# Altium project SMAQ-Board_Design.PrjPcb (part 2 of 3)

## Sheet [5] - Microphone, Sound and LEDs.SchDoc: Microphone,Sound and LEDs
size A4 portrait; ApprovedBy: Team 7; CheckedBy: Charitonidis A.; Author: Charitonidis Alexandros; CompanyName: SMAQ; DrawnBy: Charitonidis A.; Engineer: Charitonidis Alexandros; Organization: SMAQ; Address1: Glasgow; DocumentNumber: SCH-004; Revision: 1.1; SheetNumber: 5; SheetTotal: 5; TeamNumber: 7
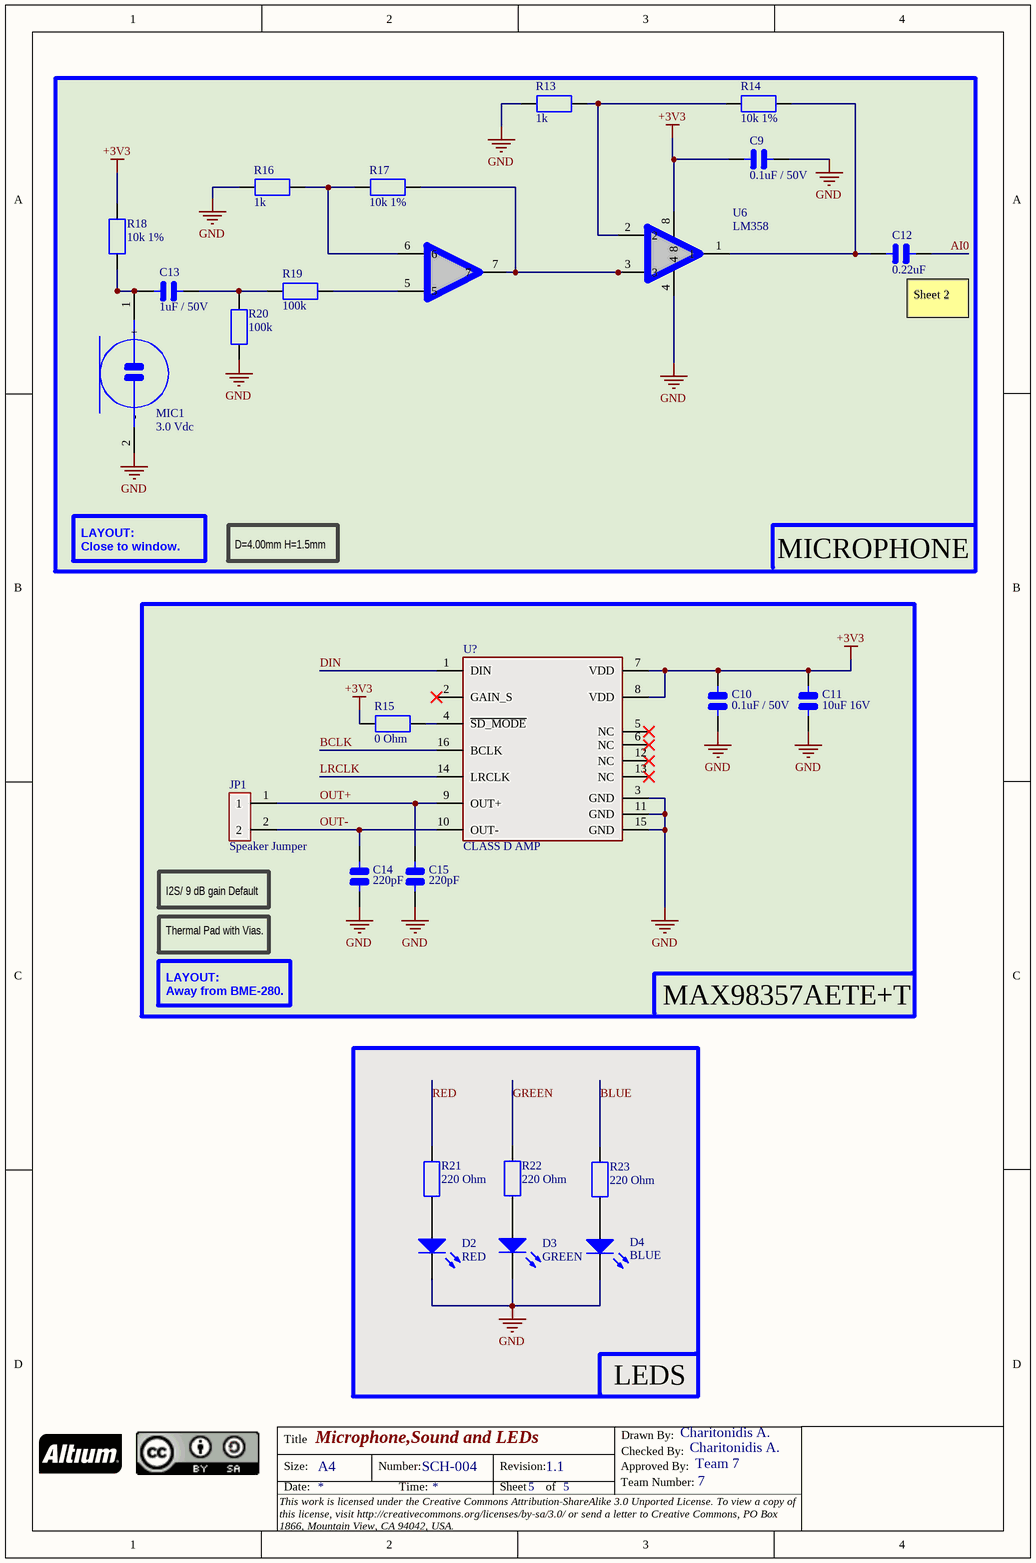
[diagram p4: [5] - Microphone, Sound and LEDs.SchDoc]

### Parts
(Parts that share a designator on the sheet are numbered #1, #2 ... from top to bottom, then left to right.)
C9#1  0.1uF / 50V  [C0805]  (no BOM)
C10#1  0.1uF / 50V  [C0805]  (no BOM)
C11#1  10uF 16V  [C0805]  (no BOM)
C12#1  0.22uF  [C0805]  (no BOM)
C13#1  1uF / 50V  [C0805]  (no BOM)
C14#1  220pF  [C0805]  (no BOM)
C15#1  220pF  [C0805]  (no BOM)
D2#1  RED  [LED-1]  (no BOM)
D3#1  GREEN  [LED-1]  (no BOM)
D4#1  BLUE  [LED-1]  (no BOM)
JP1#1  Speaker Jumper  [Speaker Jumper]  (no BOM)
MIC1#1  3.0 Vdc  [Speaker Jumper]  (no BOM)
R13#1  1k  [R0805 (2012M)]  (no BOM)
R14#1  10k 1%  [R0805 (2012M)]  (no BOM)
R15#1  0 Ohm  [R0805 (2012M)]  (no BOM)
R16#1  1k  [R0805 (2012M)]  (no BOM)
R17#1  10k 1%  [R0805 (2012M)]  (no BOM)
R18#1  10k 1%  [R0805 (2012M)]  (no BOM)
R19#1  100k  [R0805 (2012M)]  (no BOM)
R20#1  100k  [R0805 (2012M)]  (no BOM)
R21#1  220 Ohm  [R0805 (2012M)]  (no BOM)
R22#1  220 Ohm  [R0805 (2012M)]  (no BOM)
R23#1  220 Ohm  [R0805 (2012M)]  (no BOM)
U6#1  LM358  [SOIC-8]  (no BOM)
U?  CLASS D AMP  [16LTHINQFN]  (no BOM)

### Blocks framed on the sheet
MICROPHONE: C9#1 C12#1 C13#1 MIC1#1 R13#1 R14#1 R16#1 R17#1 R18#1 R19#1 R20#1 U6#1
MAX98357AETE+T: C10#1 C11#1 C14#1 C15#1 JP1#1 R15#1 U?
LEDS: D2#1 D3#1 D4#1 R21#1 R22#1 R23#1

### Nets
+3V3: C9#1.1 C10#1.2 C11#1.2 R15#1.2 R18#1.2 U6#1.8 U?.7(VDD) U?.8(VDD)
GND: C9#1.2 C10#1.1 C11#1.1 C14#1.1 C15#1.1 D2#1.2(K) D3#1.2(K) D4#1.2(K) MIC1#1.2(-) R13#1.1 R16#1.1 R20#1.1 U6#1.4 U?.3(GND) U?.11(GND) U?.15(GND)
AI0: C12#1.2
BCLK: U?.16(BCLK)
BLUE: R23#1.2
DIN: U?.1(DIN)
GREEN: R22#1.2
LRCLK: U?.14(LRCLK)
OUT+: C15#1.2 JP1#1.1 U?.9(OUT+)
OUT-: C14#1.2 JP1#1.2 U?.10(OUT-)
RED: R21#1.2
NetC12#1_1: C12#1.1 R14#1.2 U6#1.1
NetC13#1_1: C13#1.1 MIC1#1.1(+) R18#1.1
NetC13#1_2: C13#1.2 R19#1.2 R20#1.2
NetD2#1_1: D2#1.1(A) R21#1.1
NetD3#1_1: D3#1.1(A) R22#1.1
NetD4#1_1: D4#1.1(A) R23#1.1
NetR13#1_2: R13#1.2 R14#1.1 U6#1.2
NetR15#1_1: R15#1.1 U?.4(~{SD_MODE})
NetR16#1_2: R16#1.2 R17#1.2 U6#1.6
NetR17#1_1: R17#1.1 U6#1.3 U6#1.7
NetR19#1_1: R19#1.1 U6#1.5

Not connected (* = marked no-connect by the designer): U? 2(GAIN_S)* 5(NC)* 6(NC)* 12(NC)* 13(NC)*

### Notes on the sheet
- (near C12#1) Sheet 2
- LAYOUT:
  Close to window.
- D=4.00mm H=1.5mm
- (near JP1#1) I2S/ 9 dB gain Default
- Thermal Pad with Vias.
- LAYOUT:
  Away from BME-280.
- Title
- Drawn By:
- Size:
- Date:
- A4
- Number:
- Time:
- Revision:
- Sheet
- of
- Approved By:
- Team Number:
- Checked By:
- This work is licensed under the Creative Commons Attribution-ShareAlike 3.0 Unported License. To view a copy of this license, visit http://creativecommons.org/licenses/by-sa/3.0/ or send a letter to Creative Commons, PO Box 1866, Mountain View, CA 94042, USA.

### Library data of the parts
C9#1 C10#1 = 08055C104JAT4A: CAP CER 0.1UF 50V X7R 0805; Manufacturer 1: Kyocera AVX; Category 1: Ceramic Capacitors; Capacitance: 100nF; Tolerance: 5%; Supplier 1: Mouser; Manufacturer Part Number 1: 08055C104JAT4A; RoHS: Yes; Description 1: CAP CER 0.1UF 50V X7R 0805; Stock 1: 70357; Mount: Surface Mount; Case/Package: 0805; Number of Pins: 2; Case Code (Imperial): 0805; Case Code (Metric): 2012; Min Operating Temperature: -55°C; Max Operating Temperature: 125°C; Dielectric: X7R; Package Quantity: 10000; Voltage Rating: 50V; Packaging: Tape and Reel; Termination: SMD/SMT; Voltage Rating (DC): 50V; Length: 2.01mm; Depth: 1.25mm; Width: 0.049inch; Thickness: 0.037inch; Radiation Hardening: No; Lead Free: Lead Free; ComponentLink1URL: https://datasheet.ciiva.com/16326/cx7r-16326437.pdf?src-supplier=Future+Electronics; ComponentLink1Description: https://datasheet.ciiva.com/16326/cx7r-16326437.pdf?src-supplier=Future+Electronics; ComponentLink2URL: https://datasheet.ciiva.com/6277/cx7r-6277722.pdf?src-supplier=Digi-Key; ComponentLink2Description: https://datasheet.ciiva.com/6277/cx7r-6277722.pdf?src-supplier=Digi-Key; Supplier Part Number 1: 581-08055C104JAT4A
C11#1 = 0805YC106MAT2A: Manufacturer 1: Kyocera AVX; Supplier 1: Mouser; Manufacturer Part Number 1: 0805YC106MAT2A; RoHS: No; Stock 1: 1756; Supplier Part Number 1: 581-0805YC106MAT2A
C12#1 = 08053C224J4Z2A: Multilayer Ceramic Capacitors MLCC - SMD/SMT 25V 0.22uF X7R 0805 5% AEC-Q200; Manufacturer 1: Kyocera AVX; Supplier 1: Mouser; Manufacturer Part Number 1: 08053C224J4Z2A; RoHS: No; Stock 1: 37375; Supplier Part Number 1: 581-08053C224J4Z2A
C13#1 = 08055C105JAT2A: Manufacturer 1: Kyocera AVX; Category 1: Capacitors; Dielectric: X7R; Tolerance: 5%; Supplier 1: Mouser; Manufacturer Part Number 1: 08055C105JAT2A; RoHS: No; Stock 1: 5621; Voltage: 50V; Supplier Part Number 1: 581-08055C105JAT2A
C14#1 C15#1 = 08055A221F4T2A: T&R / COMMERCIAL CHIP; Manufacturer 1: Kyocera AVX; Category 1: Ceramic Capacitors; Dielectric: C0G; Voltage Rating (DC): 50V; Tolerance: 1%; Supplier 1: Mouser; Manufacturer Part Number 1: 08055A221F4T2A; RoHS: No; Description 1: T&R / COMMERCIAL CHIP; Stock 1: 6955; Case/Package: 0805; Capacitance: 220pF; Supplier Part Number 1: 581-08055A221F4T2A
D2#1 D3#1 D4#1 = LED1: Typical RED GaAs LED; Published: 8-Jun-2000; LatestRevisionDate: 08-Jul-2005; LatestRevisionNote: Mech Layer 1 removed.; PackageReference: LED-1; Publisher: Altium Limited; PackageDescription: LED; 2 Leads
MIC1#1 = CMC-4015-25L100: 4.0 mm, Omnidirectional, Wire Leads, 3.0 Vdc, IP65 Rated, Electret Condenser Microphone; Manufacturer 1: CUI Devices; Supplier 1: Mouser; Manufacturer Part Number 1: CMC-4015-25L100; Description 1: 4.0 mm, Omnidirectional, Wire Leads, 3.0 Vdc, IP65 Rated, Electret Condenser Microphone; Stock 1: 486; ComponentLink1URL: http://datasheet.octopart.com/CMC-4015-25L100-CUI-Devices-datasheet-137937391.pdf?src-supplier=CUI+Devices; ComponentLink1Description: http://datasheet.octopart.com/CMC-4015-25L100-CUI-Devices-datasheet-137937391.pdf?src-supplier=CUI+Devices; Supplier Part Number 1: 490-CMC-4015-25L100
R13#1 R16#1 = ERA-6AED102V: Res Thin Film 0805 1K Ohm 0.5% 1/8W ±25ppm/°C Molded SMD SMD Punched Carrier T/R; Manufacturer 1: Panasonic; Category 1: Chip SMD Resistors; Resistance: 1kR; Power Rating: 125mW; Voltage Rating: 100V; Supplier 1: Mouser; Manufacturer Part Number 1: ERA-6AED102V; RoHS: Yes; Description 1: Res Thin Film 0805 1K Ohm 0.5% 1/8W ±25ppm/°C Molded SMD SMD Punched Carrier T/R; Stock 1: 18492; Mount: Surface Mount; Case/Package: 0805; Case Code (Imperial): 0805; Case Code (Metric): 2012; Contact Plating: Tin; Min Operating Temperature: -55°C; Max Operating Temperature: 155°C; Packaging: Tape and Reel; Tolerance: 0.5%; Package Quantity: 5000; Composition: Thin Film; Temperature Coefficient: 25ppm/°C; Military Standard: Not; Length: 2mm; Height: 0.5mm; Width: 1.25mm; Depth: 1.25mm; Lead Free: Lead Free; ComponentLink1URL: https://datasheet.ciiva.com/9198/aoa0000ce26-9198987.pdf?src-supplier=Avnet; ComponentLink1Description: https://datasheet.ciiva.com/9198/aoa0000ce26-9198987.pdf?src-supplier=Avnet; Supplier Part Number 1: 667-ERA-6AED102V
R14#1 R17#1 R18#1 = AT0805FRE0710KL: RES SMD 10K OHM 1% 1/8W 0805; Manufacturer 1: Yageo; Category 1: Chip SMD Resistors; Resistance: 10kR; Max Power Dissipation: 125mW; Temperature Coefficient: 50ppm/°C; Supplier 1: Mouser; Manufacturer Part Number 1: AT0805FRE0710KL; RoHS: Yes; Description 1: RES SMD 10K OHM 1% 1/8W 0805; Stock 1: 12821; Case/Package: 0805; Case Code (Metric): 2012; Case Code (Imperial): 0805; Min Operating Temperature: -55°C; Max Operating Temperature: 155°C; Packaging: Tape and Reel; Composition: Thin Film; Number of Terminations: 2; Tolerance: 1%; Features: Moisture Resistant,Automotive AEC-Q200,Anti-Sulfur; Length: 0.079inch; Height: 0.024inch; Width: 0.049inch; ComponentLink1URL: http://www.yageo.com/documents/recent/PYu-AT_51_RoHS_L_5.pdf?src-supplier=Digi-Key; ComponentLink1Description: http://www.yageo.com/documents/recent/PYu-AT_51_RoHS_L_5.pdf?src-supplier=Digi-Key; ComponentLink2URL: http://www.yageo.com/documents/recent/PYu-AT_51_RoHS_L-3.pdf?src-supplier=Digi-Key; ComponentLink2Description: http://www.yageo.com/documents/recent/PYu-AT_51_RoHS_L-3.pdf?src-supplier=Digi-Key; Supplier Part Number 1: 603-AT0805FRE0710KL
R15#1 R21#1 R22#1 R23#1 = ERJ-6GEY0R00V: RES SMD 0 OHM JUMPER 1/8W 0805; Manufacturer 1: Panasonic; Category 1: Chip SMD Resistors; Resistance: 0mR; Voltage Rating: 150V; Power Rating: 125mW; Tolerance: 5%; Temperature Coefficient: 600ppm/°C; Current Rating: 2A; Supplier 1: Mouser; Manufacturer Part Number 1: ERJ-6GEY0R00V; RoHS: Yes; Description 1: RES SMD 0 OHM JUMPER 1/8W 0805; Stock 1: 960895; Mount: Surface Mount; Case/Package: 0805; Contact Plating: Tin; Case Code (Imperial): 0805; Case Code (Metric): 2012; Min Operating Temperature: -55°C; Max Operating Temperature: 155°C; Composition: Thick Film; Packaging: Tape and Reel; Package Quantity: 1; Termination: SMD/SMT; Number of Terminations: 2; Military Standard: Not; Max Power Dissipation: 125mW; Voltage Rating (DC): 150V; Features: Automotive AEC-Q200; Length: 2mm; Height: 0.6mm; Width: 1.25mm; Depth: 1.25mm; Radiation Hardening: No; Lead Free: Lead Free; REACH SVHC: No SVHC; ComponentLink1URL: https://datasheet.ciiva.com/36526/1989607-36526237.pdf?src-supplier=Jameco; ComponentLink1Description: https://datasheet.ciiva.com/36526/1989607-36526237.pdf?src-supplier=Jameco; ComponentLink2URL: https://datasheet.ciiva.com/11821/0900766b80f806dd-11821735.pdf?src-supplier=RSComponents; ComponentLink2Description: https://datasheet.ciiva.com/11821/0900766b80f806dd-11821735.pdf?src-supplier=RSComponents; ComponentLink3URL: https://datasheet.ciiva.com/43460/1678796-43460073.pdf?src-supplier=Farnell; ComponentLink3Description: https://datasheet.ciiva.com/43460/1678796-43460073.pdf?src-supplier=Farnell; ComponentLink4URL: https://datasheet.ciiva.com/9117/aoa0000ce1-9117354.pdf?src-supplier=Avnet; ComponentLink4Description: https://datasheet.ciiva.com/9117/aoa0000ce1-9117354.pdf?src-supplier=Avnet; ComponentLink5URL: https://datasheet.ciiva.com/28695/1678796-28695877.pdf?src-supplier=Element14; ComponentLink5Description: https://datasheet.ciiva.com/28695/1678796-28695877.pdf?src-supplier=Element14; ComponentLink6URL: https://datasheet.ciiva.com/46377/1678796-46377866.pdf?src-supplier=Element14; ComponentLink6Description: https://datasheet.ciiva.com/46377/1678796-46377866.pdf?src-supplier=Element14; ComponentLink7URL: https://datasheet.ciiva.com/17215/aoa0000ce1-17215390.pdf?src-supplier=Avnet+Europe; ComponentLink7Description: https://datasheet.ciiva.com/17215/aoa0000ce1-17215390.pdf?src-supplier=Avnet+Europe; ComponentLink8URL: https://datasheet.ciiva.com/16512/aoa0000ce1-16512111.pdf?src-supplier=Avnet+Asia; ComponentLink8Description: https://datasheet.ciiva.com/16512/aoa0000ce1-16512111.pdf?src-supplier=Avnet+Asia; Supplier Part Number 1: 667-ERJ-6GEY0R00V
R19#1 R20#1 = ERJ-6ENF1003V: RES SMD 100K OHM 1% 1/8W 0805; Manufacturer 1: Panasonic; Category 1: Chip SMD Resistors; Resistance: 100kR; Temperature Coefficient: 100ppm/°C; Power Rating: 125mW; Voltage Rating: 150V; Supplier 1: Mouser; Manufacturer Part Number 1: ERJ-6ENF1003V; RoHS: Yes; Description 1: RES SMD 100K OHM 1% 1/8W 0805; Stock 1: 298428; Mount: Surface Mount; Case/Package: 0805; Number of Pins: 2; Contact Plating: Tin; Case Code (Metric): 2012; Case Code (Imperial): 0805; Min Operating Temperature: -55°C; Max Operating Temperature: 155°C; Tolerance: 1%; Composition: Thick Film; Packaging: Tape and Reel; Package Quantity: 1; Number of Terminations: 2; Military Standard: Not; Termination: SMD/SMT; Max Power Dissipation: 125mW; Voltage Rating (DC): 150V; Features: Automotive AEC-Q200; Length: 2mm; Height: 0.6mm; Width: 0.049inch; Depth: 1.25mm; Radiation Hardening: No; REACH SVHC: No SVHC; Lead Free: Lead Free; ComponentLink1URL: https://datasheet.ciiva.com/11821/0900766b80f80784-11821507.pdf?src-supplier=RSComponents; ComponentLink1Description: https://datasheet.ciiva.com/11821/0900766b80f80784-11821507.pdf?src-supplier=RSComponents; ComponentLink2URL: https://datasheet.ciiva.com/27055/1988989-27055734.pdf?src-supplier=Jameco; ComponentLink2Description: https://datasheet.ciiva.com/27055/1988989-27055734.pdf?src-supplier=Jameco; ComponentLink3URL: https://datasheet.ciiva.com/17208/aoa0000ce2-17208153.pdf?src-supplier=Avnet+Europe; ComponentLink3Description: https://datasheet.ciiva.com/17208/aoa0000ce2-17208153.pdf?src-supplier=Avnet+Europe; ComponentLink4URL: https://datasheet.ciiva.com/24023/aoa0000ce2-24023497.pdf?src-supplier=Mouser; ComponentLink4Description: https://datasheet.ciiva.com/24023/aoa0000ce2-24023497.pdf?src-supplier=Mouser; ComponentLink5URL: https://datasheet.ciiva.com/7830/426256-7830746.pdf?src-supplier=Element14; ComponentLink5Description: https://datasheet.ciiva.com/7830/426256-7830746.pdf?src-supplier=Element14; ComponentLink6URL: https://datasheet.ciiva.com/16788/70260748-16788734.pdf?src-supplier=Allied+Electronics; ComponentLink6Description: https://datasheet.ciiva.com/16788/70260748-16788734.pdf?src-supplier=Allied+Electronics; ComponentLink7URL: https://datasheet.ciiva.com/48531/aoa0000ce2-48531486.pdf?src-supplier=Avnet; ComponentLink7Description: https://datasheet.ciiva.com/48531/aoa0000ce2-48531486.pdf?src-supplier=Avnet; ComponentLink8URL: https://datasheet.ciiva.com/22723/426256-22723909.pdf?src-supplier=Element14; ComponentLink8Description: https://datasheet.ciiva.com/22723/426256-22723909.pdf?src-supplier=Element14; ComponentLink9URL: https://datasheet.ciiva.com/46419/1678782-46419877.pdf?src-supplier=Element14; ComponentLink9Description: https://datasheet.ciiva.com/46419/1678782-46419877.pdf?src-supplier=Element14; ComponentLink10URL: https://datasheet.ciiva.com/16449/aoa0000ce2-16449480.pdf?src-supplier=Future+Electronics; ComponentLink10Description: https://datasheet.ciiva.com/16449/aoa0000ce2-16449480.pdf?src-supplier=Future+Electronics; ComponentLink11URL: https://datasheet.ciiva.com/22667/1678782-22667897.pdf?src-supplier=Element14; ComponentLink11Description: https://datasheet.ciiva.com/22667/1678782-22667897.pdf?src-supplier=Element14; ComponentLink12URL: https://datasheet.ciiva.com/30257/aoa0000ce2-30257690.pdf?src-supplier=Onlinecomponents.com; ComponentLink12Description: https://datasheet.ciiva.com/30257/aoa0000ce2-30257690.pdf?src-supplier=Onlinecomponents.com; ComponentLink13URL: https://datasheet.ciiva.com/7830/426256-7830988.pdf?src-supplier=Element14; ComponentLink13Description: https://datasheet.ciiva.com/7830/426256-7830988.pdf?src-supplier=Element14; ComponentLink14URL: https://datasheet.ciiva.com/16776/70260748-16776892.pdf?src-supplier=Allied+Electronics; ComponentLink14Description: https://datasheet.ciiva.com/16776/70260748-16776892.pdf?src-supplier=Allied+Electronics; Supplier Part Number 1: 667-ERJ-6ENF1003V
U6#1 = LM358DR: IC OPAMP GP 700KHZ 8SOIC; Manufacturer 1: Texas Instruments; Category 1: Amplifiers - Op Amps, Buffer, Instrumentation; Number of Circuits: 2; Max Supply Voltage: 32V; Min Supply Voltage: 3V; Nominal Supply Current: 1.2mA; Common Mode Rejection Ratio: 65dB; Min Dual Supply Voltage: 1.5V; Max Dual Supply Voltage: 16V; Voltage Gain: 100dB; Slew Rate: 0.3V/µs; Output Current: 30mA; Input Bias Current: 250nA; Input Offset Voltage (Vos): 7mV; Operating Supply Current: 1mA; Dual Supply Voltage: 9V; Supplier 1: Mouser; Manufacturer Part Number 1: LM358DR; RoHS: Yes; Description 1: IC OPAMP GP 700KHZ 8SOIC; Stock 1: 15836; Mount: Surface Mount; Case/Package: SOIC; Number of Pins: 8; Contact Plating: Gold; Min Operating Temperature: 0°C; Max Operating Temperature: 70°C; Packaging: Tape and Reel; Number of Channels: 2; Gain Bandwidth Product: 700kHz; Package Quantity: 2500; Operating Supply Voltage: 16V; Bandwidth: 700kHz; Output Current per Channel: 30mA; Number of Elements: 2; Unity Gain Bandwidth Product: 700kHz; Number of Amplifiers: 2; Power Supply Rejection Ratio (PSRR): 65dB; Length: 4.9mm; Height: 1.58mm; Width: 3.91mm; Radiation Hardening: No; Lead Free: Lead Free; REACH SVHC: No SVHC; ComponentLink1URL: https://datasheet.ciiva.com/1795/lm358-1795488.pdf?src-supplier=Digi-Key; ComponentLink1Description: https://datasheet.ciiva.com/1795/lm358-1795488.pdf?src-supplier=Digi-Key; ComponentLink2URL: https://datasheet.ciiva.com/27056/2016330-27056228.pdf?src-supplier=Jameco; ComponentLink2Description: https://datasheet.ciiva.com/27056/2016330-27056228.pdf?src-supplier=Jameco; ComponentLink3URL: https://datasheet.ciiva.com/26847/lm358dr-26847142.pdf?src-supplier=IIIC; ComponentLink3Description: https://datasheet.ciiva.com/26847/lm358dr-26847142.pdf?src-supplier=IIIC; ComponentLink4URL: https://datasheet.ciiva.com/2973/lm358a-2973386.pdf?src-supplier=Avnet; ComponentLink4Description: https://datasheet.ciiva.com/2973/lm358a-2973386.pdf?src-supplier=Avnet; ComponentLink5URL: https://datasheet.ciiva.com/46390/1874566-46390414.pdf?src-supplier=Element14; ComponentLink5Description: https://datasheet.ciiva.com/46390/1874566-46390414.pdf?src-supplier=Element14; ComponentLink6URL: https://datasheet.ciiva.com/7709/1874566-7709823.pdf?src-supplier=Element14; ComponentLink6Description: https://datasheet.ciiva.com/7709/1874566-7709823.pdf?src-supplier=Element14; ComponentLink7URL: https://datasheet.ciiva.com/1795/lm358-1795489.pdf?src-supplier=Digi-Key; ComponentLink7Description: https://datasheet.ciiva.com/1795/lm358-1795489.pdf?src-supplier=Digi-Key; ComponentLink8URL: https://datasheet.ciiva.com/46385/1874566-46385851.pdf?src-supplier=Element14; ComponentLink8Description: https://datasheet.ciiva.com/46385/1874566-46385851.pdf?src-supplier=Element14; ComponentLink9URL: https://datasheet.ciiva.com/1795/lm358-1795487.pdf?src-supplier=Digi-Key; ComponentLink9Description: https://datasheet.ciiva.com/1795/lm358-1795487.pdf?src-supplier=Digi-Key; Supplier Part Number 1: 595-LM358DR
U? = MAX98357AETE+T: IC AUDIO AMP CLASS D 16-TQFN; Manufacturer 1: Maxim; Category 1: Amplifiers - Audio; Voltage Gain: 15dB; Min Supply Voltage: 2.5V; Max Supply Voltage: 5.5V; Max Output Power: 3.2W; Power Supply Rejection Ratio (PSRR): 77dB; Max Power Dissipation: 1.666W; Max Output Current: 1.6A; Supplier 1: Mouser; Manufacturer Part Number 1: MAX98357AETE+T; RoHS: Yes; Description 1: IC AUDIO AMP CLASS D 16-TQFN; Stock 1: 6162; Mount: Surface Mount; Number of Pins: 16; Contact Plating: Tin,Matte; Min Operating Temperature: -40°C; Max Operating Temperature: 85°C; Packaging: Tape and Reel; Radiation Hardening: No; ComponentLink1URL: https://datasheet.ciiva.com/29970/max98357a-max98357b-29970280.pdf?src-supplier=Avnet; ComponentLink1Description: https://datasheet.ciiva.com/29970/max98357a-max98357b-29970280.pdf?src-supplier=Avnet; Supplier Part Number 1: 700-MAX98357AETE+T